# EAGLE design JDM2_2-Voltage_SW1P (EAGLE 7.7.0)
JDM2 with selectable Dual-Voltage
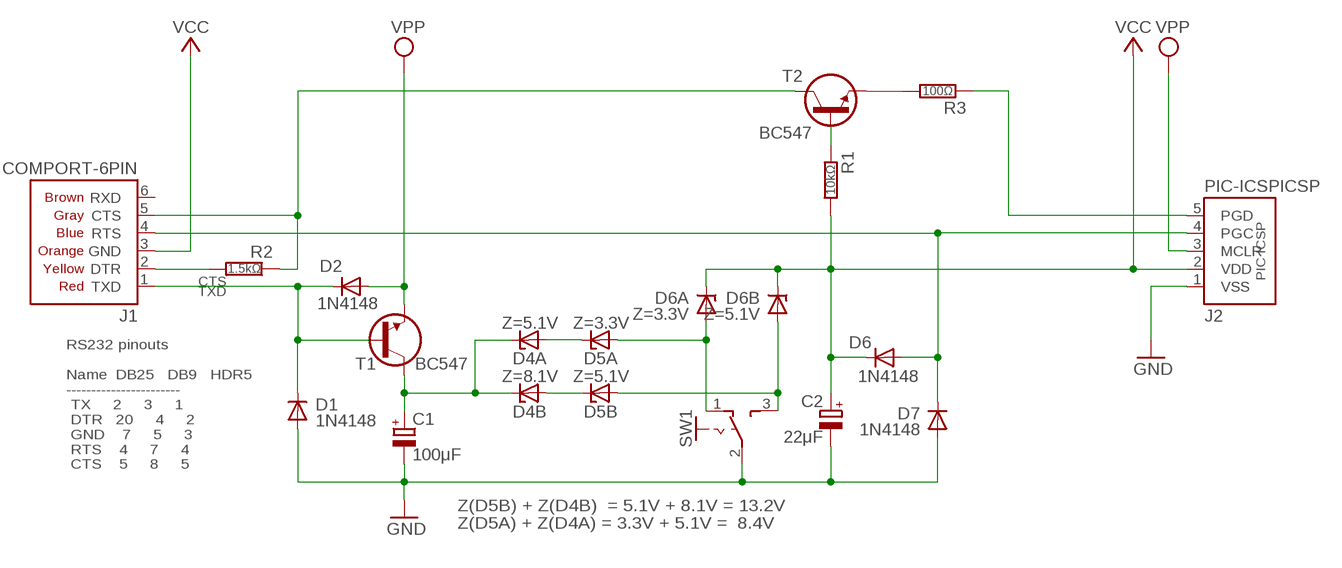
[diagram p0: schematic, sheet 1]

## Parts
C1  100μF  CPOLE2.5-5  [E2,5-5]
C2  22μF  CPOLE2,5-4  [E2,5-4]
D1  1N4148  1N414834-5V  [DO34-5V]
D2  1N4148  1N414834-5  [DO34-5]
D4A  Z=5.1V  Z-DIODE34Z5  [DO34Z5]
D4B  Z=8.1V  Z-DIODE34Z5  [DO34Z5]
D5A  Z=3.3V  Z-DIODE34Z5  [DO34Z5]
D5B  Z=5.1V  Z-DIODE34Z5  [DO34Z5]
D6  1N4148  1N414834-5V  [DO34-5V]
D6A  Z=3.3V  Z-DIODE34Z7V  [DO34Z7V]
D6B  Z=5.1V  Z-DIODE34Z7V  [DO34Z7V]
D7  1N4148  1N414834-5V  [DO34-5V]
J1  COMPORT-6PIN  [RS232-6PIN]
J2  PIC-ICSPICSP  [PIC-ICSP]
R1  10kΩ  R0202/7-V  [0202/7-V]
R2  1.5kΩ  R0202/7-V  [0202/7-V]
R3  100Ω  R0202/10  [0202/10]
SW1  SL-SW-1P-2T-H  [SLSW-1P2T-H]
T1  BC547  BC547CBE  [TO92-CBE]
T2  BC547  BC547CBE  [TO92-CBE]

## Nets
/MCLR: D2.A J2.3(MCLR) T1.E ; supply symbol labelled VPP
CLK: D6.A D7.C J1.4(RTS) J2.4(PGC)
CTS: J1.5(CTS) R2.1 T2.C
DATA: R3.2 T2.E
GND: C1.- C2.- D1.A D7.A J2.1(VSS) SW1.2(P)
N$1: R1.1 T2.B
N$2: D5A.A D6A.A SW1.1(O)
N$3: D5B.A D6B.A SW1.3(S)
N$4: D4A.A D5A.C
N$5: D4B.A D5B.C
N$7: J1.2(DTR) R2.2
PGD: J2.5(PGD) R3.1
TXD: D1.C D2.C J1.1(TXD) T1.B
VCC: C2.+ D6.C D6A.C D6B.C J1.3(GND) J2.2(VDD) R1.2
VPP: C1.+ D4A.C D4B.C T1.C
Unconnected: J1.6(RXD)

## Notes on the sheet
- RS232 pinouts
  
  Name  DB25   DB9   HDR5
  -----------------------
   TX     2     3     1
   DTR   20     4     2
   GND    7     5     3
   RTS    4     7     4
   CTS    5     8     5
- Z(D5B) + Z(D4B)  = 5.1V + 8.1V = 13.2V
  Z(D5A) + Z(D4A) = 3.3V + 5.1V =  8.4V

## Library data of the parts
C1 C2 = c:CPOL: POLARIZED CAPACITOR, European symbol
D1 D2 D6 D7 = d:1N4148
D4A D4B D5A D5B D6A D6B = d:Z-DIODE
J1 = pinconn:COMPORT-6PIN
J2 = pinconn:PIC-ICSP
R1-R3 = r:R: RESISTOR, European symbol
SW1 = sw:SL-SW-1P-2T
T1 T2 = t:BC547

## Net classes
0 default: width 0.559 mm
1 power: width 0.559 mm

## Board
JDM2 with selectable Dual-Voltage
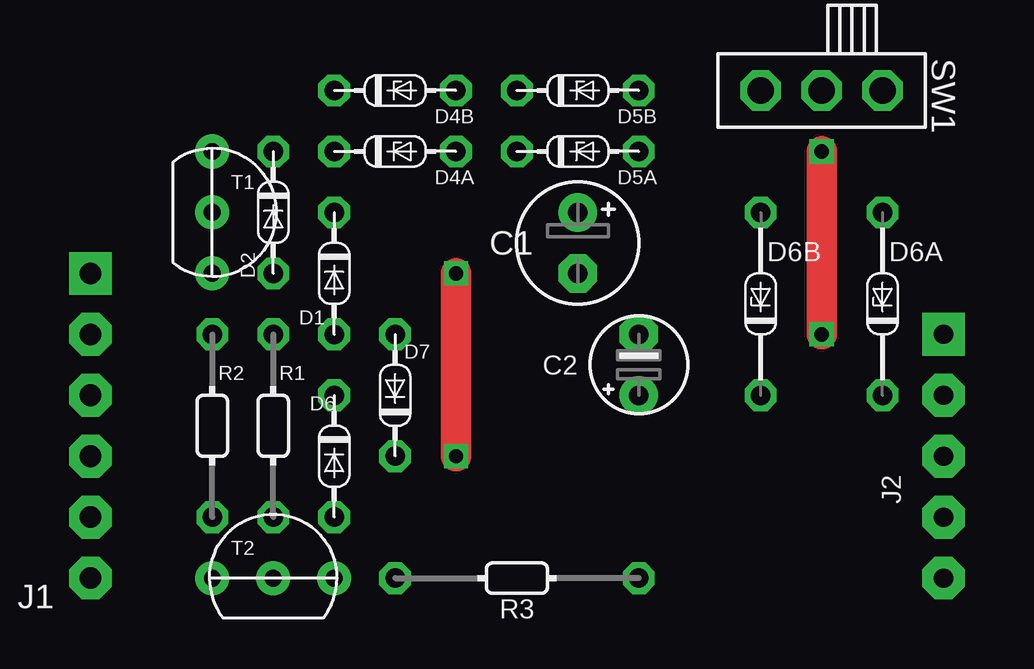
[diagram p1: board, top side]
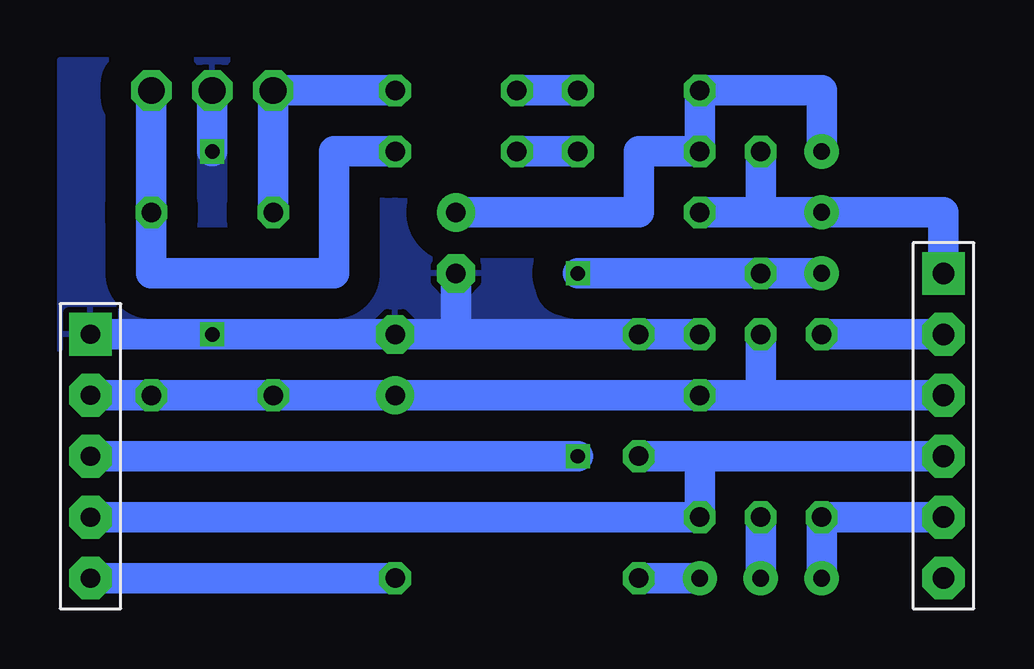
[diagram p2: board, bottom side, seen from below]

No outline drawn. Coordinates in mm, seen from the top.
Copper layers (1*16): Top 0.035mm / dielectric 1.5mm / Bottom 0.035mm
Design rules "default": minimum track width 10mil, minimum drill 24mil, track to track 8mil, track to pad 8mil, pad to pad 8mil, via to via 8mil, smd to smd 8mil, copper to edge 40mil, drill to drill 8mil, minimum pad ring 10mil, minimum via ring 8mil, stop-mask expansion 4mil, vias tented up to drill 0mil, thermal gap 10mil

### Footprints (pad centres in the part's own frame; a part is rotated, then mirrored left to right if it is on the bottom)
E2,5-5 = drill 0.813 pad 1.6: + 1.27,0 | drill 0.813 pad 1.6 octagon: - -1.27,0
E2,5-4 = drill 0.813 pad 1.6: + 0,-1.27 | drill 0.813 pad 1.6 octagon: - 0,1.27
DO34-5V = drill 0.813 octagon: A 0,2.54; C 0,-2.54
DO34-5 = drill 0.813 octagon: A 2.54,0; C -2.54,0
DO34Z5 = drill 0.813 octagon: A -2.54,0; C 2.54,0
DO34Z7V = drill 0.813 octagon: A 0,3.81; C 0,-3.81
RS232-6PIN = drill 0.9 pad 1.778 square: 1 0,0 | drill 0.9 pad 1.778 octagon: 2 0,2.54; 3 0,5.08; 4 0,7.62; 5 0,10.16; 6 0,12.7
PIC-ICSP = drill 0.8 pad 1.778 square: 1 0,0 | drill 0.8 pad 1.778 octagon: 2 2.54,0; 3 5.08,0; 4 7.62,0; 5 10.16,0
0202/7-V = drill 0.813 octagon: 1 0,-3.81; 2 0,3.81
0202/10 = drill 0.813 octagon: 1 0,-5.08; 2 0,5.08
SLSW-1P2T-H = drill 1.118 pad 1.524 octagon: 1 2.54,0; 2 0,0; 3 -2.54,0
TO92-CBE = drill 0.7 pad 1.422: B 0,0; C 0,2.54; E 0,-2.54

### Placement (x,y rotation side)
C1  21.59,15.24 90 top
C2  24.13,10.16 0 top
D1  11.43,13.97 180 top
D2  8.89,16.51 270 top
D4A  13.97,19.05 180 top
D4B  13.97,21.59 180 top
D5A  21.59,19.05 180 top
D5B  21.59,21.59 180 top
D6  11.43,6.35 180 top
D6A  34.29,12.7 0 top
D6B  29.21,12.7 0 top
D7  13.97,8.89 0 top
J1  1.27,13.97 180 top
J2  36.83,11.43 270 top
R1  8.89,7.62 0 top
R2  6.35,7.62 0 top
R3  19.05,1.27 90 top
SW1  31.75,21.59 0 top
T1  6.35,16.51 0 top
T2  8.89,1.27 90 top

### Tracks (layer width: path | path; a pad name or v marks a point on that pad's centre or on a via)
/MCLR  (via drill 0.6)
  Top 1.27: v16.51,6.35 v16.51,13.97
  Bottom 1.27: J2.3 v16.51,6.35 | D2.A v16.51,13.97 T1.E
CLK
  Bottom 1.27: J2.4 D6.A 11.43,6.35 D7.C J1.4
CTS
  Bottom 1.27: J1.5 R2.1 T2.C
DATA  (via drill 0.6)
  Bottom 1.27: T2.E R3.2
  other vias: 11.43,1.27
GND  (via drill 0.6)
  Top 1.27: v31.75,19.05 v31.75,11.43
  Bottom 1.27: C2.- D7.A D1.A | C1.- 21.59,11.43 | 21.59,11.43 20.32,11.43 | 21.59,11.43 C2.- | J2.1 v31.75,11.43 C2.- | SW1.2 v31.75,19.05
  pour Bottom (isolate 1.27): 0,22.86 38.1,22.86 38.1,0 0,0
  pour Bottom (isolate 1.27): 38.1,22.86 0,22.86 0,0 38.1,0
N$1
  Bottom 1.27: R1.1 T2.B
N$2
  Bottom 1.27: SW1.1 D6A.A 34.29,13.97 26.67,13.97 26.67,19.05 D5A.A
N$3
  Bottom 1.27: D6B.A SW1.3 D5B.A
N$4
  Bottom 1.27: D4A.A D5A.C
N$5
  Bottom 1.27: D4B.A D5B.C
N$7
  Bottom 1.27: R2.2 J1.2
PGD
  Bottom 1.27: R3.1 J2.5
TXD
  Bottom 1.27: J1.1 1.27,16.51 T1.B 8.89,16.51 | D2.C 8.89,16.51 | D1.C 8.89,16.51
VCC
  Bottom 1.27: C2.+ 8.89,8.89 | J1.3 8.89,8.89 | 8.89,8.89 R1.2 | C2.+ D6.C | J2.2 D6A.C D6B.C C2.+
VPP
  Bottom 1.27: T1.C 6.35,21.59 D4B.C D4A.C 13.97,19.05 13.97,16.51 C1.+

### Text on the board
Dimension: 9 | 8 | 7 | 6 | 5 | 4 | 3 | 2 | 1
Measures: 1 | 2 | 3 | 4 | 5 | 6 | 7 | 8 | 9 | 10 | 11 | 12 | 13 | 14